# EAGLE design open-access-interlock-v1-1-relay (EAGLE 5.11)
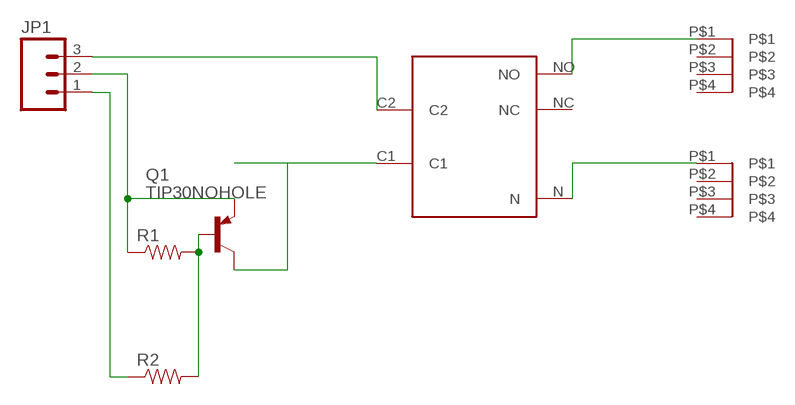
[diagram p0: schematic, sheet 1]

## Parts
JP1  M03LONGPADS  [1X03_LONGPADS]
Q1  TIP30NOHOLE  [TO220-NOHOLE]
R1  RESISTORAXIAL-0.3  [AXIAL-0.3]
R2  RESISTORAXIAL-0.3  [AXIAL-0.3]
U$1  OUDH-SH-105D  [A]
U$2  7691  [7691]
U$3  7691  [7691]

## Nets
N$1: U$1.NO U$2.P$1
N$2: U$1.N U$3.P$1
N$3: Q1.2(C) U$1.C1
N$4: JP1.1 R2.P$1
N$5: Q1.1(B) R1.P$2 R2.P$2
N$6: JP1.2 Q1.3(E) R1.P$1
N$7: JP1.3 U$1.C2
Unconnected: U$1.NC U$2.P$2 U$2.P$3 U$2.P$4 U$3.P$2 U$3.P$3 U$3.P$4

## Library data of the parts
JP1 = SparkFun:M03: Header 3 Standard 3-pin 0.1" header. Use with straight break away headers (SKU : PRT-00116), right angle break away headers (PRT-00553), swiss pins (PRT-00743), machine pins (PRT-00117), and female headers (PRT-00115). Molex polarized connector foot print use with SKU : PRT-08232 with associated crimp pins and housings.
Q1 = adafruit:TIP30: PNP Transistor
R1 R2 = SparkFun:RESISTOR: Resistor Basic schematic elements and footprints for 0603, 1206, and PTH resistors.
U$1 = will-oudh-sh-105d:OUDH-SH-105D: Relay
U$2 U$3 = 7691 terminal:7691

## Board
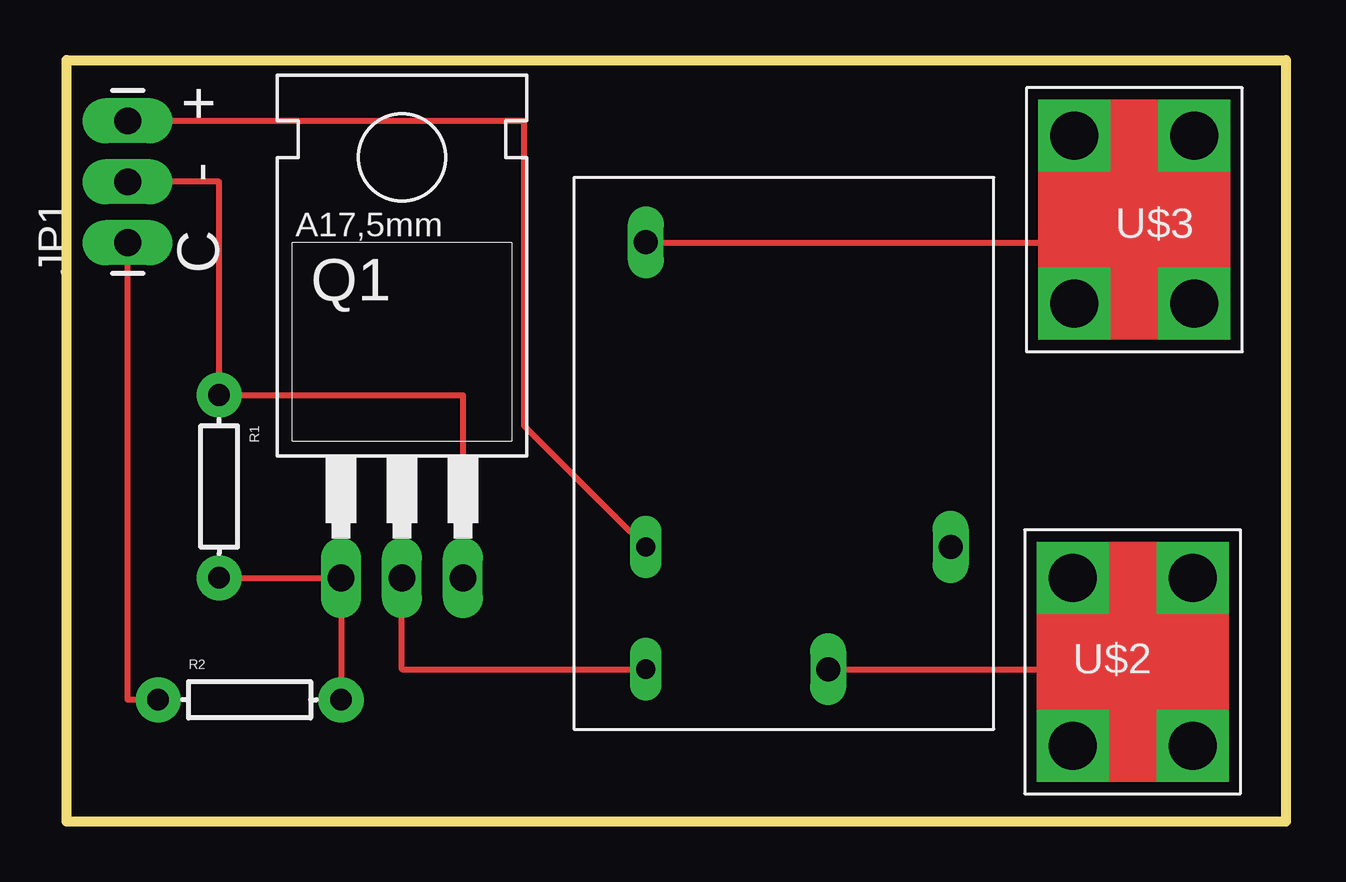
[diagram p1: board, top side]
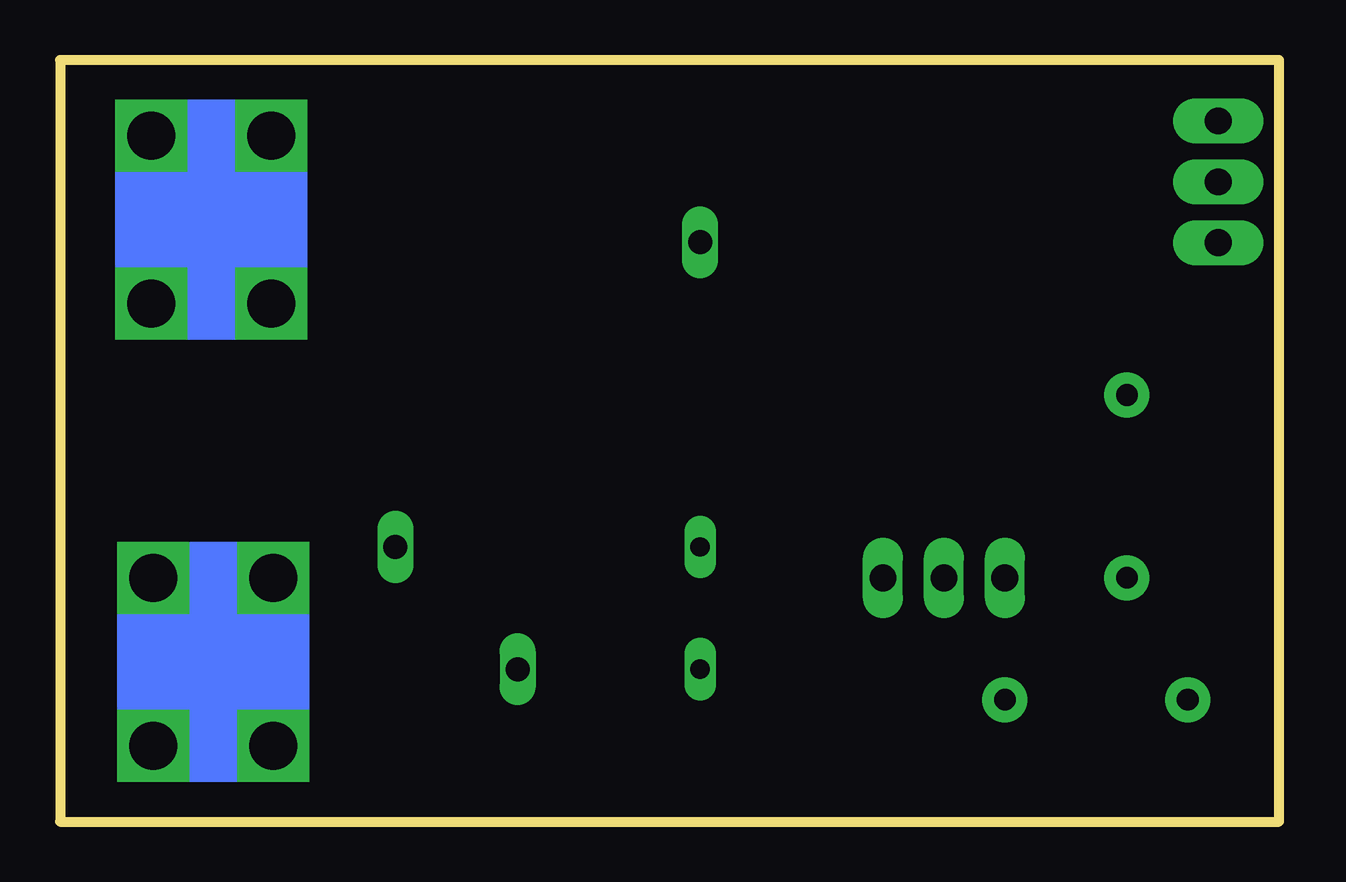
[diagram p2: board, bottom side, seen from below]

Size 50.8 x 31.75 mm. Coordinates in mm from the lower left corner, seen from the top.
Outline: 0,0 0,31.75 50.8,31.75 50.8,0 0,0
Copper layers (1*16): Top 0.035mm / dielectric 1.5mm / Bottom 0.035mm
Design rules "default": minimum track width 10mil, minimum drill 24mil, track to track 8mil, track to pad 8mil, pad to pad 8mil, via to via 8mil, smd to smd 8mil, copper to edge 40mil, drill to drill 8mil, minimum pad ring 10mil, minimum via ring 8mil, stop-mask expansion 4mil, vias tented up to drill 0mil, thermal gap 10mil

### Footprints (pad centres in the part's own frame; a part is rotated, then mirrored left to right if it is on the bottom)
1X03_LONGPADS = drill 1.118 pad 1.88 long: 1 0,0; 2 2.54,0; 3 5.08,0
TO220-NOHOLE = drill 1.118 long: 1 -2.54,-6.35; 2 0,-6.35; 3 2.54,-6.35
AXIAL-0.3 = drill 0.9 pad 1.88 round: P$1 -3.81,0; P$2 3.81,0
A = drill 0.8 long: C1 0,0; C2 5.1,0 | drill 1 long: N 17.8,0; NC 5.1,-12.7; NO 0,-7.6
7691 = drill 2 square: P$1 0,0; P$2 5,0; P$3 0,-7; P$4 5,-7

### Placement (x,y rotation side)
JP1  2.54,24.13 90 top
Q1  13.97,16.51 0 top
R1  6.35,13.97 270 top
R2  7.62,5.08 0 top
U$1  24.13,6.35 90 top
U$2  41.91,10.16 0 top
U$3  46.99,21.59 180 top

### Tracks (layer width: path | path; a pad name or v marks a point on that pad's centre or on a via)
N$1
  Top 0.254: U$2.P$1 40.64,10.16 41.91,8.89 41.91,6.35 U$1.NO
N$2
  Top 0.254: U$3.P$1 44.45,24.13 24.13,24.13 U$1.N
  Bottom 0.254: U$1.N 24.13,24.13
N$3
  Top 0.254: U$1.C1 13.97,6.35 Q1.2
N$4
  Top 0.254: R2.P$1 2.54,5.08 JP1.1
N$5
  Top 0.254: R1.P$2 Q1.1 R2.P$2
N$6
  Top 0.254: JP1.2 6.35,26.67 R1.P$1 16.51,17.78 Q1.3
N$7
  Top 0.254: JP1.3 19.05,29.21 19.05,16.51 22.86,12.7 U$1.C2

### Text on the board
tNames: + | - | C